# EAGLE design carret_actuator (EAGLE 5.11)
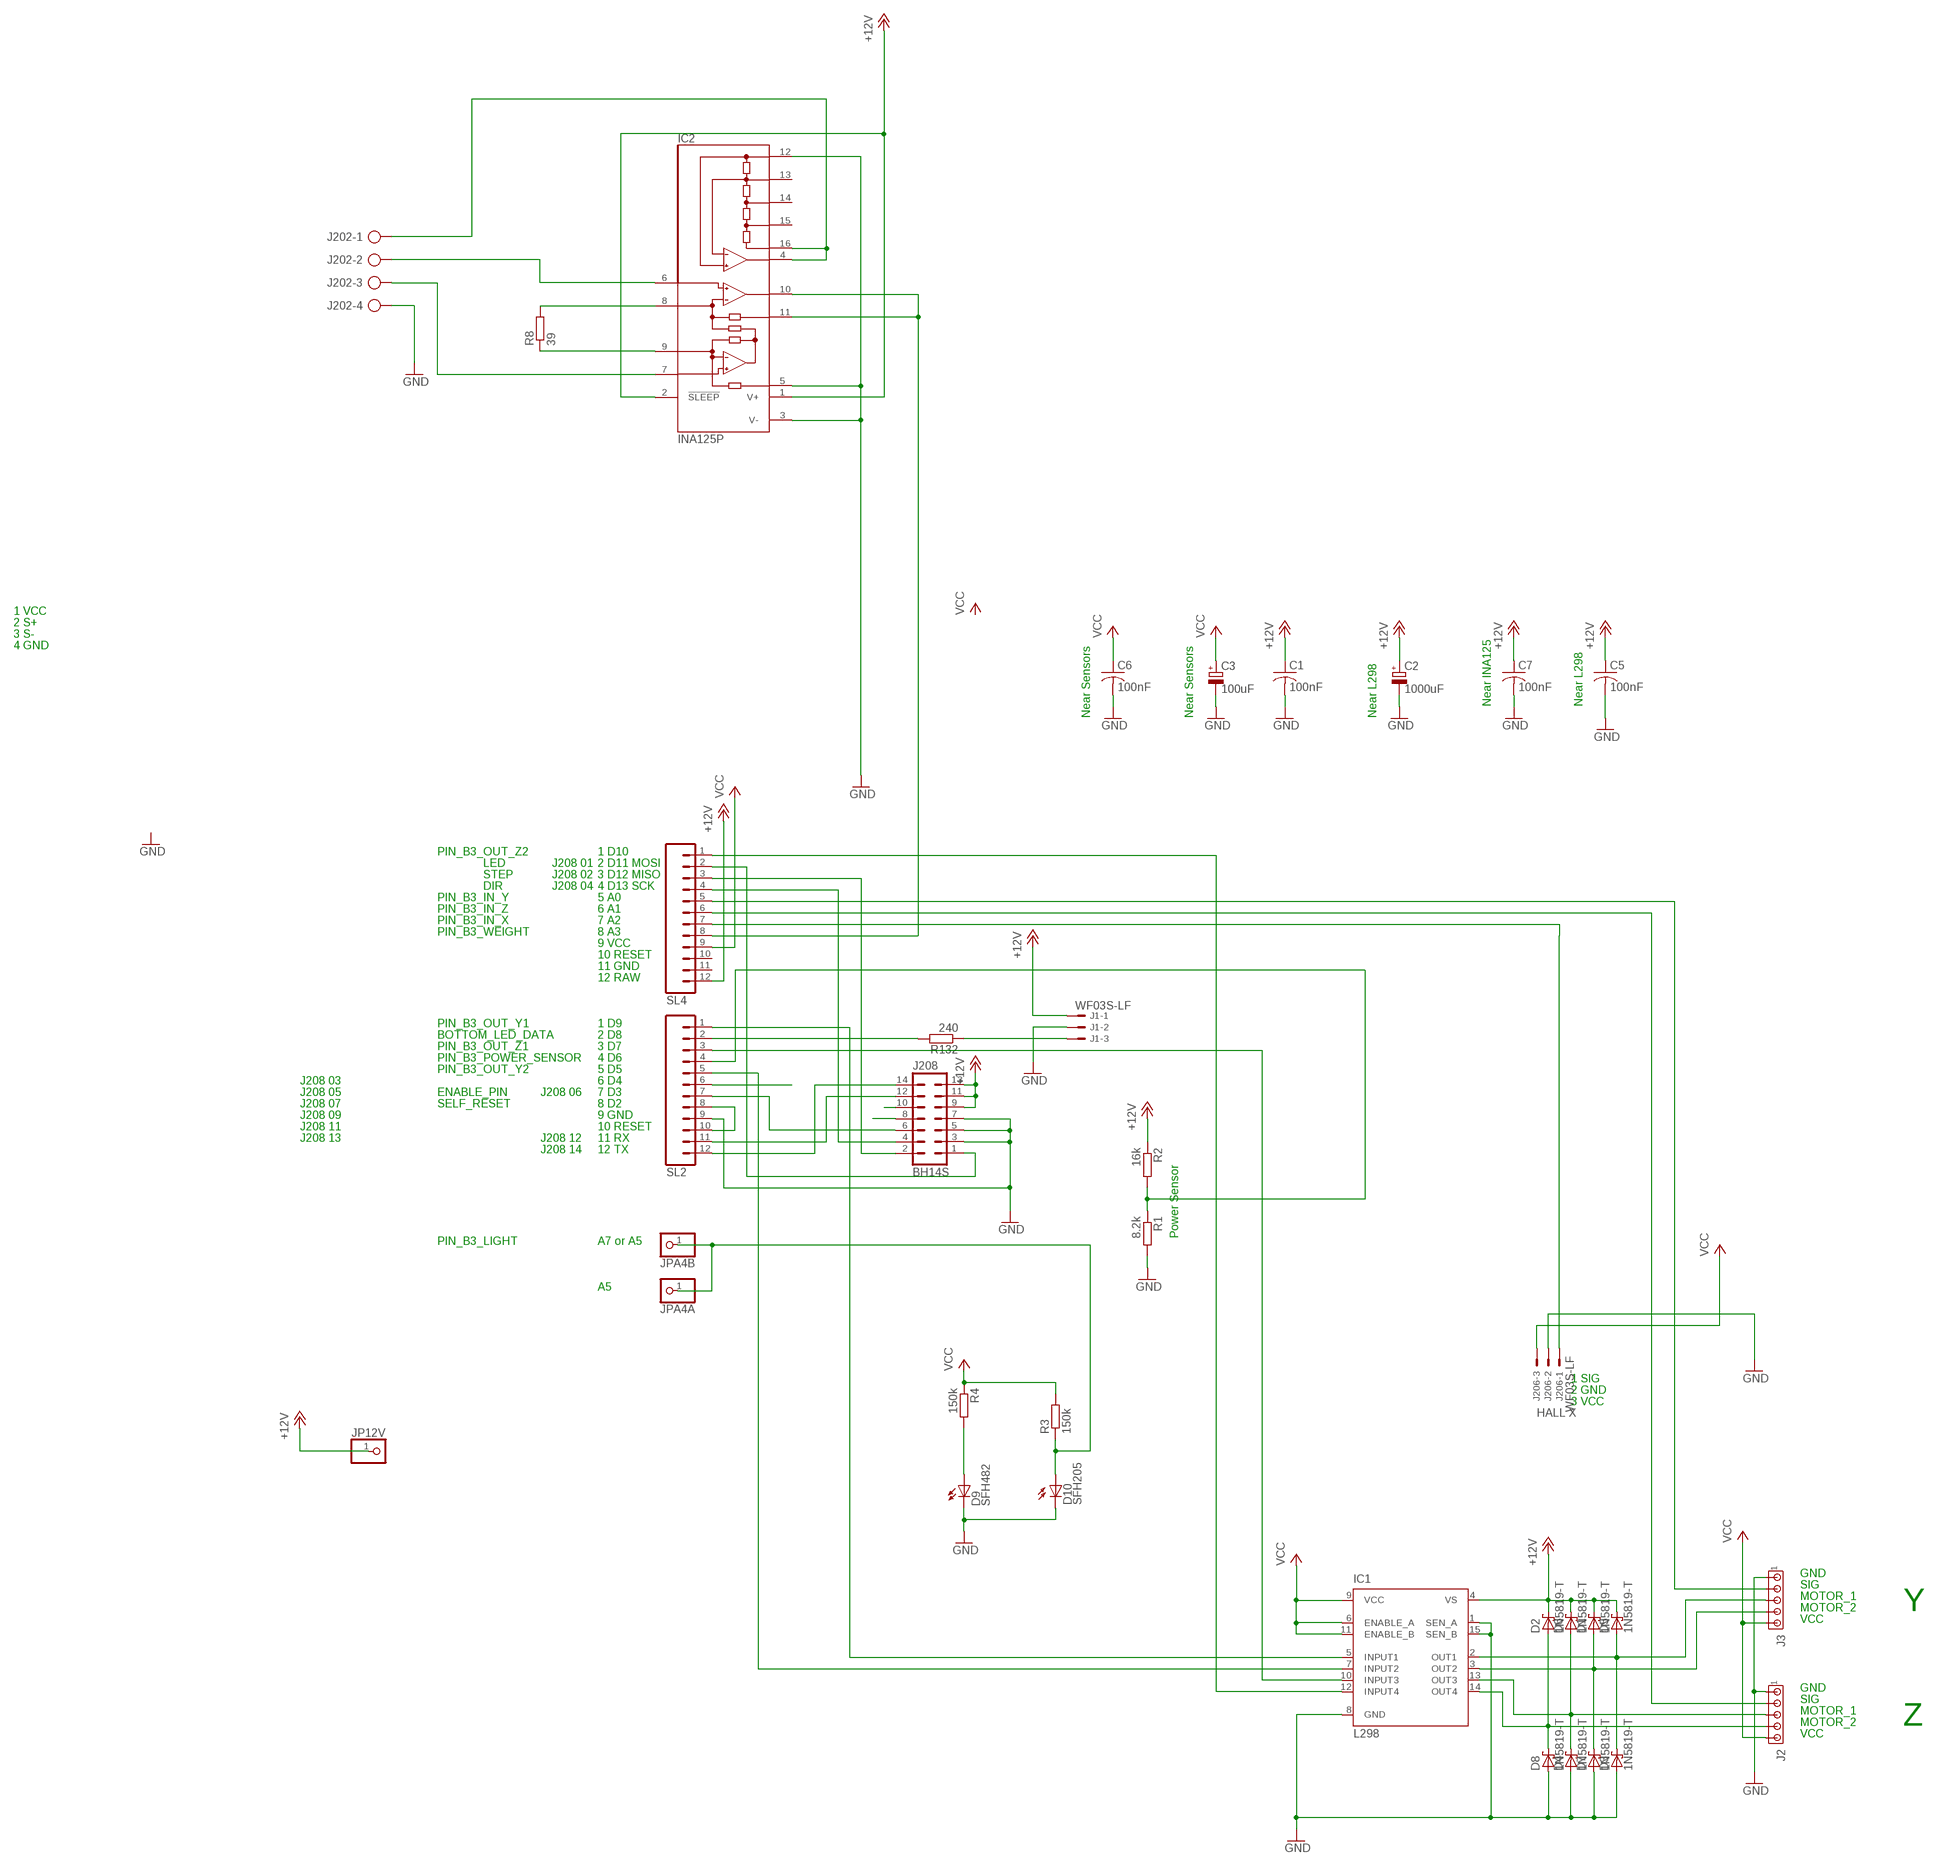
[diagram p0: schematic, sheet 1]

## Parts
C1  100nF  C-US050-030X075  [C050-030X075]
C2  1000uF  CPOL-EUE5-10.5  [E5-10,5]
C3  100uF  CPOL-EUE3.5-8  [E3,5-8]
C5  100nF  C-US050-030X075  [C050-030X075]
C6  100nF  C-US050-030X075  [C050-030X075]
C7  100nF  C-US050-030X075  [C050-030X075]
D1  1N5819-T  [DO41-7.6]
D2  1N5819-T  [DO41-7.6]
D3  1N5819-T  [DO41-7.6]
D4  1N5819-T  [DO41-7.6]
D5  1N5819-T  [DO41-7.6]
D6  1N5819-T  [DO41-7.6]
D7  1N5819-T  [DO41-7.6]
D8  1N5819-T  [DO41-7.6]
D9  SFH482  [SFH482]
D10  SFH205  [SFH205]
IC1  L298  [MULTIWATT-15]
IC2  INA125P  [DIL16]
J1  WF03S-LF  22-27-2031-03  [6410-03]
J2  MTA05-100  [10X05MTA]
J3  MTA05-100  [10X05MTA]
J202  AK300/4  [AK300/4]
J206  WF03S-LF  22-27-2031-03  [6410-03]
J208  BH14S  ML14  [ML14]
JP12V  PINHD-1X1  [1X01]
JPA4A  PINHD-1X1  [1X01]
JPA4B  PINHD-1X1  [1X01]
R1  8.2k  R-EU_0207/10  [0207/10]
R2  16k  R-EU_0207/10  [0207/10]
R3  150k  R-EU_0207/10  [0207/10]
R4  150k  R-EU_0207/10  [0207/10]
R8  39  R-EU_0207/10  [0207/10]
R132  240  R-EU_0207/10  [0207/10]
SL2  M12  [12P]
SL4  M12  [12P]

## Nets
+12V [power12]: C1.1 C2.+ C5.1 C7.1 D1.C D2.C D5.C D6.C IC1.4(VS) IC2.1(V+) IC2.2(!SLEEP) J1.1 J208.9 J208.11 J208.13 JP12V.1 R2.1 SL4.12
GND [ground]: C1.2 C2.- C3.- C5.2 C6.2 C7.2 D3.A D4.A D7.A D8.A D9.K(C) D10.K(C) IC1.1(SEN_A) IC1.8(GND) IC1.15(SEN_B) IC2.3(V-) IC2.5(REF) IC2.12(REFCOM) J1.2 J2.1 J3.1 J202.4 J206.2 J208.3 J208.5 J208.7 R1.2 SL2.9
N$1: J1.3 R132.1
N$2: J208.14 SL2.12
N$3: R132.2 SL2.2
N$4: IC1.10(INPUT3) SL2.3
N$5: J206.1 SL4.7
N$6: J208.1 SL4.2
N$7: J208.12 SL2.11
N$8: J208.2 SL4.3
N$9: J208.10
N$10: IC1.12(INPUT4) SL4.1
N$11: J208.8
N$12: J208.4 SL4.4
N$13: IC2.6(+IN) J202.2
N$14: D9.A R4.2
N$15: SL2.8 SL2.10
N$16: J3.2 SL4.5
N$17 [power6]: D2.A D8.C IC1.14(OUT4) J2.4
N$18: R1.1 R2.2 SL2.4
N$19: IC1.7(INPUT2) SL2.5
N$20 [power6]: D4.C D6.A IC1.13(OUT3) J2.3
N$21: IC1.5(INPUT1) SL2.1
N$22 [power6]: D1.A D7.C IC1.3(OUT2) J3.4
N$23 [power6]: D3.C D5.A IC1.2(OUT1) J3.3
N$24: SL2.6
N$25: IC2.4(REFOUT) IC2.16(REF10) J202.1
N$26: IC2.7(-IN) J202.3
N$27: J208.6 SL2.7
N$28: J2.2 SL4.6
N$29: D10.A JPA4A.1 JPA4B.1 R3.1
N$30: IC2.8(RG) R8.2
N$31: IC2.9(RG) R8.1
N$41: IC2.10(OUT) IC2.11(SENSE) SL4.8
VCC [power5]: C3.+ C6.1 IC1.6(ENABLE_A) IC1.9(VCC) IC1.11(ENABLE_B) J2.5 J3.5 J206.3 R3.2 R4.1 SL4.9
Unconnected: IC2.13(REFBG) IC2.14(REF2.5) IC2.15(REF5) SL4.10 SL4.11

## Notes on the sheet
- 1 VCC
- 2 S+
- 3 S-
- 4 GND
- Near INA125 | Near L298
- Near Sensors | Near Sensors | Near L298
- PIN_B3_OUT_Z2 | 1 D10
- LED | J208 01 | 2 D11 MOSI
- STEP | J208 02 | 3 D12 MISO
- DIR | J208 04 | 4 D13 SCK
- PIN_B3_IN_Y | 5 A0
- PIN_B3_IN_Z | 6 A1
- PIN_B3_IN_X | 7 A2
- PIN_B3_WEIGHT | 8 A3
- 9 VCC
- 10 RESET
- 11 GND
- 12 RAW
- PIN_B3_OUT_Y1 | 1 D9
- BOTTOM_LED_DATA | 2 D8
- PIN_B3_OUT_Z1 | 3 D7
- PIN_B3_POWER_SENSOR | 4 D6
- PIN_B3_OUT_Y2 | 5 D5
- J208 03 | 6 D4
- J208 05 | ENABLE_PIN | J208 06 | 7 D3
- J208 07 | SELF_RESET | 8 D2
- J208 09 | 9 GND
- J208 11 | 10 RESET
- J208 13 | J208 12 | 11 RX
- J208 14 | 12 TX
- Power Sensor
- PIN_B3_LIGHT | A7 or A5
- A5
- 1 SIG
- 2 GND
- 3 VCC
- HALL X
- GND
- SIG
- MOTOR_1
- MOTOR_2 | Y
- VCC
- GND
- SIG
- MOTOR_1
- MOTOR_2 | Z
- VCC

## Library data of the parts
C1 C5-C7 = resistor:C-US: CAPACITOR, American symbol
C2 C3 = rcl:CPOL-EU: POLARIZED CAPACITOR, European symbol
D1-D8 = diode:1N581*: 1.0A SCHOTTKY BARRIER RECTIFIER Source: http://www.diodes.com/datasheets/ds23001.pdf
D9 = led:SFH482: IR LED infrared emitting diode, Infineon
D10 = opto-trans-siemens:SFH205: PHOTO DIODE; OC_FARNELL: unknown; OC_NEWARK: unknown
IC1 = st-microelectronics:L298: DUAL FULL-BRIDGE DRIVER; MPN: L298N; OC_FARNELL: 1589425; OC_NEWARK: 32M1527
IC2 = burr-brown:INA125: Instrumentation Amplifier with Precision Voltage Reference; MF: TEXAS INSTRUMENT CONNECTORS; MPN: INA125P; OC_FARNELL: 1459461; OC_NEWARK: 35C1726
J1 J206 = con-molex:22-?-03: CONNECTOR wire to board 2.54 mm (.1 inch) pitch header; OC_FARNELL: unknown; OC_NEWARK: unknown
J2 J3 = con-amp:MTA05-100: AMP connector; OC_FARNELL: unknown; OC_NEWARK: unknown
J202 = con-ptr500:AK300/4: CONNECTOR; OC_FARNELL: unknown; OC_NEWARK: unknown
J208 = con-ml:ML14: HARTING; OC_FARNELL: unknown; OC_NEWARK: unknown
JP12V JPA4A JPA4B = pinhead:PINHD-1X1: PIN HEADER
R1-R4 R8 R132 = rcl:R-EU_: RESISTOR, European symbol
SL2 SL4 = con-amp-quick:M12: AMP QUICK CONNECTOR; OC_FARNELL: unknown; OC_NEWARK: unknown

## Net classes
0 default: width 0.381 mm, drill 0.254 mm, clearance 0.254 mm
1 power12: width 1.778 mm
2 ground: width 0.508 mm
3 power5: width 0.508 mm
4 power6: width 1.27 mm

## Board
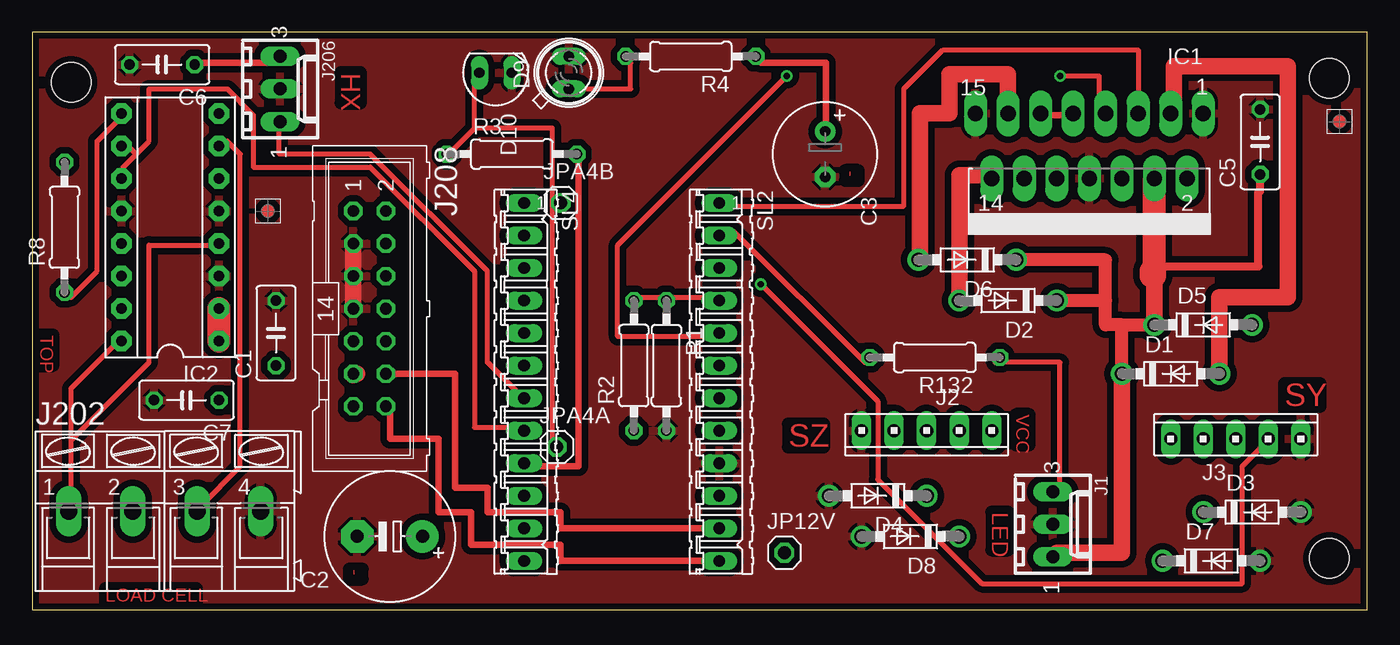
[diagram p1: board, top side]
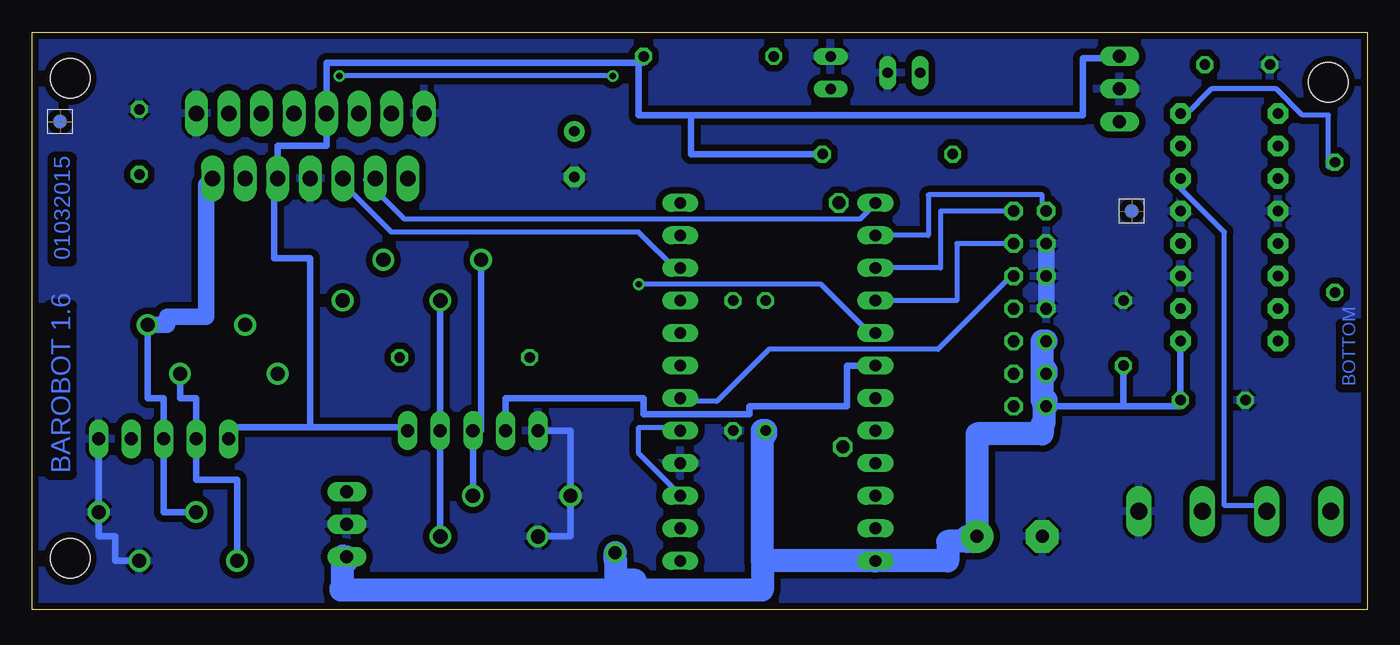
[diagram p2: board, bottom side, seen from below]

Size 104.27 x 45.09 mm. Coordinates in mm from the lower left corner, seen from the top.
Outline: 0,0 104.27,0 104.27,45.09 0,45.09 0,0
Copper layers (1*16): Top 0.035mm / dielectric 1.5mm / Bottom 0.035mm
Design rules "default *": minimum track width 10mil, minimum drill 0.5mm, track to track 10mil, track to pad 10mil, pad to pad 8mil, via to via 10mil, smd to smd 8mil, copper to edge 20mil, drill to drill 8mil, minimum pad ring 10mil, minimum via ring 8mil, stop-mask expansion 0mil, vias tented up to drill 0mil, thermal gap 10mil
Holes 3.1 mm at 101.3,41.47 3.05,41.15 101.3,4
vRestrict: area 20.3,32.4 to 58.4,45.1

### Footprints (pad centres in the part's own frame; a part is rotated, then mirrored left to right if it is on the bottom)
C050-030X075 = drill 0.813 octagon: 1 -2.54,0; 2 2.54,0
E5-10,5 = drill 1.016 pad 2.54 round: + -2.54,0 | drill 1.016 pad 2.54 octagon: - 2.54,0
E3,5-8 = drill 0.813 pad 1.6 round: + -1.778,0 | drill 0.813 pad 1.6 octagon: - 1.778,0
DO41-7.6 = drill 1.1 pad 1.7 round: A 3.81,0; C -3.81,0
SFH482 = drill 0.813 long: A -1.27,0; K 1.27,0
SFH205 = drill 0.813 long: A 0,-1.27; K 0,1.27
MULTIWATT-15 = drill 1.2 long: 1 -8.89,-7.62; 2 -7.62,-2.54; 3 -6.35,-7.62; 4 -5.08,-2.54; 5 -3.81,-7.62; 6 -2.54,-2.54; 7 -1.27,-7.62; 8 0,-2.54; 9 1.27,-7.62; 10 2.54,-2.54; 11 3.81,-7.62; 12 5.08,-2.54; 13 6.35,-7.62; 14 7.62,-2.54; 15 8.89,-7.62
DIL16 = drill 0.813 pad 1.6 octagon: 1 -8.89,-3.81; 2 -6.35,-3.81; 3 -3.81,-3.81; 4 -1.27,-3.81; 5 1.27,-3.81; 6 3.81,-3.81; 7 6.35,-3.81; 8 8.89,-3.81; 9 8.89,3.81; 10 6.35,3.81; 11 3.81,3.81; 12 1.27,3.81; 13 -1.27,3.81; 14 -3.81,3.81; 15 -6.35,3.81; 16 -8.89,3.81
6410-03 = drill 1.016 long: 1 2.54,0; 2 0,0; 3 -2.54,0
10X05MTA = drill 1.016 long: 1 5.08,0; 2 2.54,0; 3 0,0; 4 -2.54,0; 5 -5.08,0
AK300/4 = drill 1.321 long: 1 -7.493,0; 2 -2.515,0; 3 2.515,0; 4 7.493,0
ML14 = drill 0.914 octagon: 1 -7.62,-1.27; 2 -7.62,1.27; 3 -5.08,-1.27; 4 -5.08,1.27; 5 -2.54,-1.27; 6 -2.54,1.27; 7 0,-1.27; 8 0,1.27; 9 2.54,-1.27; 10 2.54,1.27; 11 5.08,-1.27; 12 5.08,1.27; 13 7.62,-1.27; 14 7.62,1.27
1X01 = drill 1.016 octagon: 1 0,0
0207/10 = drill 0.813 octagon: 1 -5.08,0; 2 5.08,0
12P = drill 0.914 long: 1 -13.97,0; 2 -11.43,0; 3 -8.89,0; 4 -6.35,0; 5 -3.81,0; 6 -1.27,0; 7 1.27,0; 8 3.81,0; 9 6.35,0; 10 8.89,0; 11 11.43,0; 12 13.97,0

### Placement (x,y rotation side)
C1  19.05,21.59 90 top
C2  27.94,5.71 180 top
C3  61.91,35.56 270 top
C5  95.89,36.51 90 top
C6  10.16,42.55 180 top
C7  12.06,16.35 180 top
D1  88.9,18.41 0 top
D2  76.2,24.13 180 top
D3  95.25,7.62 0 top
D4  66.04,8.89 180 top
D5  91.44,22.23 0 top
D6  73.03,27.3 180 top
D7  92.08,3.81 0 top
D8  68.58,5.71 180 top
D9  41.91,41.91 90 top
D10  36.2,41.91 270 top
IC1  82.55,31.11 180 top
IC2  10.79,29.84 90 top
J1  79.69,6.67 270 top
J2  69.85,13.97 180 top
J3  93.98,13.34 0 top
J202  10.37,7.68 0 top
J206  19.37,40.64 270 top
J208  26.35,23.5 270 top
JP12V  58.74,4.45 0 top
JPA4A  40.96,12.7 0 top
JPA4B  41.27,31.75 0 top
R1  49.53,19.05 270 top
R2  46.99,19.05 90 top
R3  37.47,35.56 0 top
R4  51.44,43.18 180 top
R8  2.54,29.84 90 top
R132  70.48,19.68 180 top
SL2  53.66,17.78 270 top
SL4  38.42,17.78 270 top
U$1  [FIDUCIAL_G10S]  18.41,31.11 0 top
U$2  [FIDUCIAL_G10S]  102.08,38.1 0 top
U$3  [FIDUCIAL_G10S]  102.08,38.1 0 bottom
U$4  [FIDUCIAL_G10S]  18.41,31.11 0 bottom

### Tracks (layer width: path | path; a pad name or v marks a point on that pad's centre or on a via)
+12V
  Top 0.61: C5.1 95.89,32.64 95.76,32.64 95.76,26.8 87.63,26.8
  Top 1.016: 85.09,22.23 83.82,22.23 83.82,24.13 | 85.09,22.23 D5.C | 83.82,24.13 83.82,27.3 D6.C | 83.82,24.13 D2.C | D1.C 85.09,22.23
  Top 1.27: 25.08,18.29 J208.11 25.4,18.41 | D1.C 85.09,4.45 80.01,4.45 80.01,4.13 J1.1 | D5.C 87.63,26.04 | 87.63,26.67 87.63,26.8
  Top 1.778: IC2.1 IC2.2 | 87.63,26.8 IC1.4 | 87.63,26.67 87.63,26.42 87.38,26.42 87.38,26.04 87.63,26.04
  Bottom 0.508: 19.05,15.88 14.61,15.88 C7.1 IC2.1 | 19.05,15.88 J208.13 | 19.05,15.88 C1.1
  Bottom 1.778: J208.9 25.4,20.95 25.4,18.67 25.08,18.67 J208.11 25.4,18.41 25.4,16.38 25.08,16.38 25.08,16 | 25.08,16 25.27,16 25.27,14.48 25.4,14.48 25.4,13.72 30.48,13.72 C2.+ 31.24,5.71 31.24,5.33 | J208.13 25.08,16 | 31.24,5.33 30.86,5.33 | 31.24,5.33 32.77,5.33 32.77,3.81 SL4.12 47.24,3.81 | 47.24,3.81 47.24,1.52 57.15,1.52 | 47.24,3.81 47.24,13.72 | 47.24,13.72 47.24,13.97 | 57.15,1.52 80.14,1.52 80.14,1.65 80.01,1.65 80.01,3.81 | 80.01,3.81 79.69,3.81 J1.1 | 80.01,3.81 80.01,4.19 | 47.24,13.72 46.99,13.72 R2.1 | JP12V.1 58.74,3.81 58.67,3.81 58.67,2.29 57.15,2.29 57.15,1.52
GND
  Top 1.27: J208.7 J208.3
  Bottom 0.508: J3.1 D3.A 99.06,5.71 97.79,5.71 97.79,3.81 D7.A | D4.A 62.23,13.97 J2.1 | D8.A 62.23,5.71 62.23,8.26
  Bottom 1.27: J208.7 J208.5 J208.3
  pour Top (isolate 0.508, rank 3): 0,45.09 104.14,45.09 104.14,0 0,0
  pour Bottom (isolate 0.508): 0,45.09 104.14,45.09 104.27,0 0,0
N$1
  Top 0.381: R132.1 75.18,19.3 80.26,19.3 80.26,9.14 J1.3
N$2
  Top 0.508: SL2.12 41.27,3.81 41.27,5.08 34.29,5.08 34.29,7.62 31.75,7.62 31.75,13.34 27.94,13.34 27.94,15.88 J208.14
N$3
  Top 0.381: R132.2 65.02,19.3 54.86,29.46 53.85,29.46 SL2.2
N$4
  Bottom 0.381: SL2.3 53.85,26.42 56.9,29.46 76.2,29.46 80.26,33.53 IC1.10
N$5
  Top 0.381: SL4.7 38.61,16.26 35.56,19.3 35.56,26.42 26.42,35.56 19.3,35.56 19.3,37.59 J206.1
N$6
  Bottom 0.406: SL4.2 34.29,29.21 34.29,32.38 25.4,32.38 25.4,31.11 J208.1
N$7
  Top 0.508: SL2.11 41.27,6.35 41.27,7.62 35.56,7.62 35.56,9.53 33.02,9.53 33.02,18.41 J208.12
N$8
  Bottom 0.406: J208.2 33.34,31.11 33.34,26.67 SL4.3
N$10
  Bottom 0.381: SL4.1 38.61,31.5 39.62,30.48 75.18,30.48 78.23,33.53 IC1.12
N$12
  Bottom 0.406: J208.4 32.07,28.57 32.07,24.13 SL4.4
N$13
  Bottom 0.381: IC2.6 15.24,33.53 11.18,29.46 11.18,8.13 8.13,8.13 J202.2
N$14
  Top 0.381: D9.A 46.74,40.64 46.74,42.67 R4.2
N$15
  Bottom 0.381: SL2.10 53.85,9.14 56.9,12.19 56.9,14.22 53.85,14.22 SL2.8
N$16  (via drill 0.5)
  Top 0.381: v56.9,25.4 66.04,16.26 66.04,10.16 74.17,2.03 94.49,2.03 94.49,11.18 96.52,13.21 J3.2
  Bottom 0.381: v56.9,25.4 42.67,25.4 38.61,21.34 SL4.5
N$17
  Top 1.27: IC1.14 74.93,33.91 72.39,33.91 D2.A
  Bottom 0.508: D2.A J2.4 D8.C
N$18
  Top 0.381: 49.78,24.38 46.74,24.38 R2.2 | 49.78,24.38 52.83,24.38 SL2.4 | 49.78,24.38 R1.1
N$19  (via drill 0.5)
  Top 0.381: v58.93,41.66 45.72,28.45 45.72,21.34 52.83,21.34 SL2.5 | v80.26,41.66 83.31,41.66 83.31,39.62 IC1.7
  Bottom 0.381: v58.93,41.66 v80.26,41.66
N$20
  Top 1.27: D4.C 69.98,8.89 | 69.34,27.43 69.34,27.3 | 69.34,27.43 69.34,38.73 71.63,38.73 71.63,41.78 76.2,41.78 IC1.13 | 69.34,27.43 69.09,27.43 69.09,27.3 D6.A
  Bottom 0.508: D6.A 69.22,13.97 J2.3 D4.C
N$21
  Top 0.381: SL2.1 53.85,31.5 68.07,31.5 68.07,40.64 71.12,43.69 86.36,43.69 IC1.5
N$22
  Top 1.27: IC1.3 88.9,39.24 89.15,39.24 89.15,42.42 98.04,42.42 98.04,24.38 92.71,24.38 D1.A
  Bottom 0.508: D1.A 92.71,16.51 91.44,16.51 J3.4 91.44,10.16 88.27,10.16 D7.C
N$23
  Bottom 0.508: D5.A 95.25,16.51 93.98,16.51 J3.3 93.98,7.62 D3.C
  Bottom 1.27: IC1.2 90.17,33.15 90.68,33.15 90.68,22.86 93.73,22.86 93.73,22.23 D5.A
N$25
  Top 0.381: 3.05,13.21 3.05,8.13 J202.1 | 3.05,13.21 3.05,17.27 7.11,21.34 IC2.16 | 3.05,13.21 9.14,19.3 9.14,28.45 14.22,28.45 IC2.4
N$26
  Top 0.381: IC2.7 15.24,36.58 16.26,35.56 16.26,11.18 13.21,8.13 J202.3
N$27
  Bottom 0.381: J208.6 27.43,26.42 33.53,20.32 46.74,20.32 50.8,16.26 52.83,16.26 SL2.7
N$28
  Bottom 0.508: J2.2 67.31,16.51 56.52,16.51 56.52,15.24 48.26,15.24 48.26,15.88 40.64,15.88 40.64,19.05 SL4.6
N$29
  Top 0.381: 34.54,37.59 32.51,35.56 R3.1 | 34.54,37.59 34.54,41.66 D10.A | 40.64,31.5 40.64,13.21 JPA4A.1 | 34.54,37.59 40.64,37.59 40.64,31.5 | 40.64,31.5 JPA4B.1
N$30
  Bottom 0.381: R8.2 3.05,34.54 3.05,38.61 5.08,38.61 7.11,40.64 12.19,40.64 14.22,38.61 IC2.8
N$31
  Top 0.381: R8.1 3.05,24.38 5.08,26.42 5.08,36.58 7.11,38.61 IC2.9
N$41
  Top 0.381: 8.13,35.56 7.11,34.54 7.11,33.53 IC2.11 | 8.13,35.56 9.14,36.58 9.14,40.64 15.24,40.64 17.27,38.61 17.27,34.54 26.42,34.54 34.54,26.42 34.54,14.22 37.59,14.22 SL4.8 | 8.13,35.56 7.11,36.58 IC2.10
VCC
  Top 0.508: C6.1 12.7,42.67 19.3,42.67 19.3,43.18 J206.3 | SL4.9 38.61,11.43 38.61,11.18 42.67,11.18 42.67,35.56 R3.2 | C3.+ 61.91,37.59 61.98,37.59 61.98,42.67 56.9,42.67 56.9,43.18 R4.1 | IC1.11 78.74,38.61 81.28,38.61 IC1.9
  Bottom 0.508: 85.34,33.53 85.09,33.53 IC1.6 | IC1.6 85.09,36.2 81.28,36.2 IC1.9 81.28,42.67 56.9,42.67 | J3.5 88.9,13.21 88.39,13.21 88.39,14.22 82.55,14.22 | 82.55,14.22 74.93,14.22 J2.5 | 52.83,38.61 52.83,35.56 R3.2 | 52.83,38.61 56.9,38.61 56.9,42.67 | 52.83,38.61 22.23,38.61 22.23,43.05 19.37,43.05 J206.3 | 56.9,42.67 56.52,42.67 R4.1 | 82.55,14.22 82.55,27.43 85.34,27.43 85.34,33.53 | IC1.6 85.34,33.66 85.34,33.53

### Text on the board
Top: HX | - | TOP | SY | VCC | SZ | LED | - | LOAD CELL
Bottom: 01032015 | BOTTOM | BAROBOT 1.6